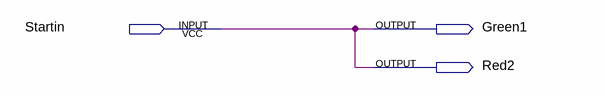
[diagram p0: schematic sheet]
// Quartus schematic Start.bdf as structural Verilog: 0 symbols, 3 pins
module Start (
  input  Startin,
  output Green1,
  output Red2
);


  assign Green1 = Startin;
  assign Red2 = Startin;
endmodule
